# EAGLE design INA250-Evaluation (EAGLE 9.1.3)
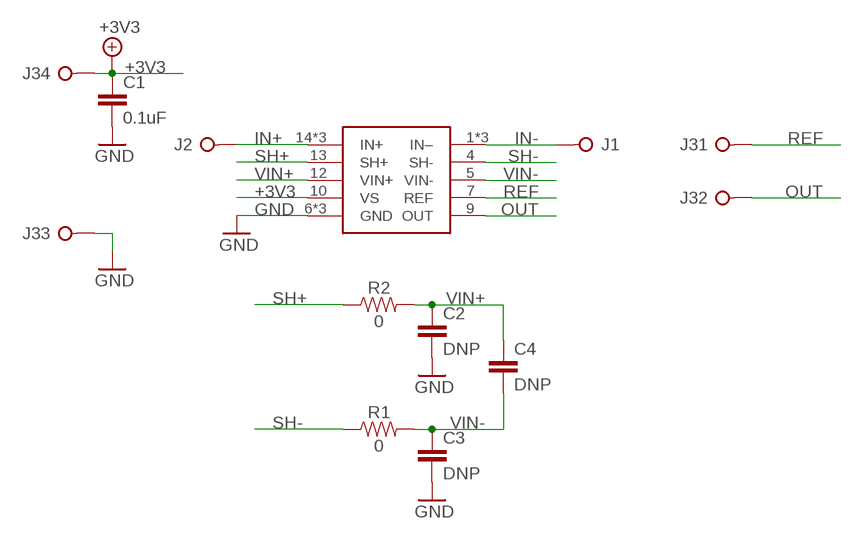
[diagram p0: schematic, sheet 1]

## Parts
C1  0.1uF  CAPACITOR-0805  [CAPACITOR-0805]
C2  DNP  CAPACITOR-0805  [CAPACITOR-0805]
C3  DNP  CAPACITOR-0805  [CAPACITOR-0805]
C4  DNP  CAPACITOR-0805  [CAPACITOR-0805]
IC1  INA250  [TSSOP-16]
J1  PINHD-1X1BIG  [1X01-BIG]
J2  PINHD-1X1BIG  [1X01-BIG]
J3  PINHD-1X4  [1X04]
R1  0  RESISTOR-0805  [RESISTOR-0805]
R2  0  RESISTOR-0805  [RESISTOR-0805]

## Nets
+3V3: C1.1 IC1.10(VS) J3.4
GND: C1.2 C2.2 C3.2 IC1.6(GND) IC1.8(GND) IC1.11(GND) J3.3
IN+: IC1.14(IN+) IC1.15(IN+) IC1.16(IN+) J2.1(KL)
IN-: IC1.1(IN–) IC1.2(IN–) IC1.3(IN–) J1.1(KL)
OUT: IC1.9(OUT) J3.2
REF: IC1.7(REF) J3.1
SH+: IC1.13(SH+) R2.1
SH-: IC1.4(SH-) R1.1
VIN+: C2.1 C4.1 IC1.12(VIN+) R2.2
VIN-: C3.1 C4.2 IC1.5(VIN-) R1.2

## Library data of the parts
C1-C4 = SaintGimp:CAPACITOR: Ceramic Capacitor
IC1 = SaintGimp:INA250: Current Amplifier With Integrated Shunt
J1 J2 = SaintGimp:PINHD-1X1
J3 = SaintGimp:PINHD-1X4
R1 R2 = SaintGimp:RESISTOR-*

## Board
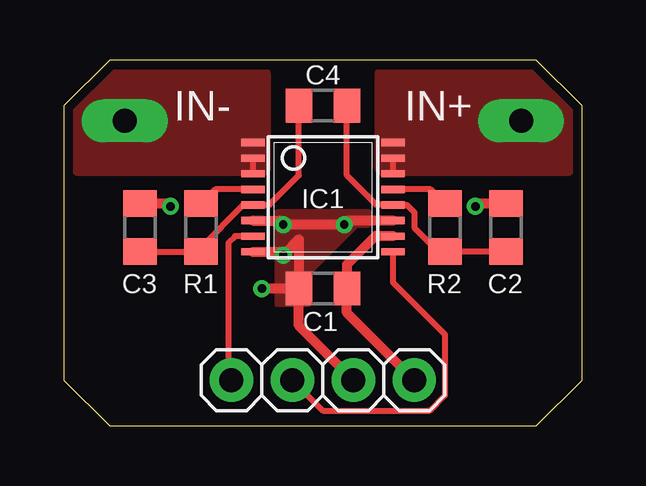
[diagram p1: board, top side]
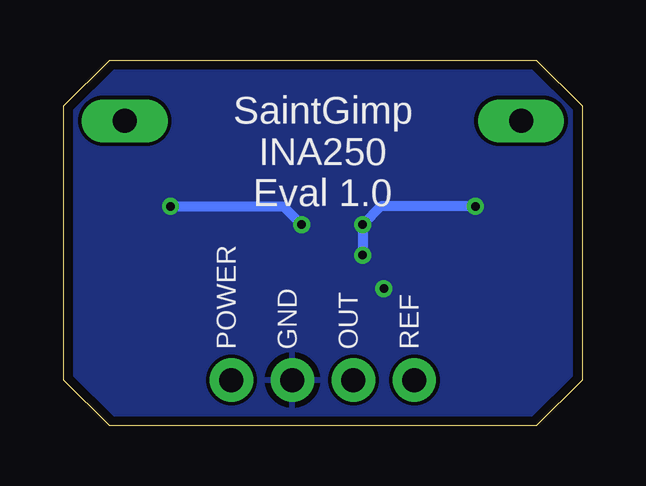
[diagram p2: board, bottom side, seen from below]

Size 21.59 x 15.24 mm. Coordinates in mm from the lower left corner, seen from the top.
Outline: 0,13.34 0,1.91 1.91,0 19.68,0 21.59,1.91 21.59,13.34 19.68,15.24 1.91,15.24 0,13.34
Copper layers (1*16): Top 0.0356mm / dielectric 1.5011mm / Bottom 0.0356mm
Design rules "Saintgimp-OSHPark": minimum track width 10mil, minimum drill 13mil, track to track 6mil, track to pad 6mil, pad to pad 6mil, via to via 6mil, smd to smd 6mil, copper to edge 15mil, drill to drill 6mil, minimum pad ring 12mil, minimum via ring 7mil, stop-mask expansion 2mil, vias tented up to drill 24mil, thermal gap 10mil

### Footprints (pad centres in the part's own frame; a part is rotated, then mirrored left to right if it is on the bottom)
CAPACITOR-0805 = smd 1.1 x 1.4: 1 -1,0; 2 1,0
TSSOP-16 = smd 0.305 x 0.991: 1 -2.275,-2.918; 2 -1.625,-2.918; 3 -0.975,-2.918; 4 -0.325,-2.918; 5 0.325,-2.918; 6 0.975,-2.918; 7 1.625,-2.918; 8 2.275,-2.918; 9 2.275,2.918; 10 1.625,2.918; 11 0.975,2.918; 12 0.325,2.918; 13 -0.325,2.918; 14 -0.975,2.918; 15 -1.625,2.918; 16 -2.275,2.918
1X01-BIG = drill 1 long: 1 0,0
1X04 = drill 1: 1 -3.81,0; 2 -1.27,0; 3 1.27,0; 4 3.81,0
RESISTOR-0805 = smd 1.1 x 1.4: 1 -1,0; 2 1,0

### Placement (x,y rotation side)
C1  10.79,5.71 180 top
C2  18.41,8.26 90 top
C3  3.17,8.26 90 top
C4  10.79,13.34 180 top
IC1  10.79,9.53 270 top
J1  2.54,12.7 90 top
J2  19.05,12.7 90 top
J3  10.79,1.91 0 top
R1  5.71,8.26 270 top
R2  15.88,8.26 270 top

### Tracks (layer width: path | path; a pad name or v marks a point on that pad's centre or on a via)
+3V3
  Top 0.406: J3.4 11.79,4.71 C1.1 11.79,6.71 12.98,7.9 IC1.10
GND  (via drill 0.35)
  Top 0.406: IC1.6 8.98,8.55 v9.14,8.38 v11.68,8.38 11.85,8.55 IC1.11 | IC1.8 9.01,7.25 v9.14,7.11 9.79,7.76 C1.2 | C1.2 v8.26,5.71 | C2.2 17.26,9.26 v17.14,9.14 | J3.3 9.79,4.17 C1.2 | v4.45,9.14 4.33,9.26 C3.2
  Bottom 0.406: v9.14,7.11 v9.14,8.38 8.38,9.14 v4.45,9.14 | v17.14,9.14 12.45,9.14 v11.68,8.38
  pour Bottom: 0,0 0,15.24 21.59,15.24 21.59,0
  pour Top (no thermals): 12.7,8.89 8.89,8.89 8.89,5.08 10.16,5.08 10.16,6.35 11.43,7.62 12.19,8.38 12.45,8.38 12.7,8.38
IN+
  Top 0.254: IC1.15 IC1.14
  pour Top (no thermals): 13.34,10.79 20.95,10.79 20.95,14.61 13.34,14.61
IN-
  Top 0.254: IC1.2 IC1.3
  pour Top (no thermals): 8.26,10.79 0.64,10.79 0.64,14.61 8.26,14.61
OUT
  Top 0.254: J3.2 10.79,0.64 15.24,0.64 15.88,1.27 15.88,3.81 13.71,5.97 IC1.9
REF
  Top 0.254: IC1.7 7.14,7.9 6.86,7.62 6.86,2.03 J3.1
SH+
  Top 0.254: R2.1 15.28,9.85 IC1.13
SH-
  Top 0.254: IC1.4 6.31,9.85 R1.1
VIN+
  Top 0.254: C2.1 R2.2 15.61,7.25 14.61,8.26 14.61,8.89 14.29,9.2 IC1.12 13.03,9.2 11.79,10.43 C4.1
VIN-
  Top 0.254: C3.1 R1.2 5.71,7.43 7.48,9.2 IC1.5 8.56,9.2 9.79,10.43 C4.2

### Text on the board
tPlace: IN- | IN+
bPlace: SaintGimp / INA250 / Eval 1.0 | REF | OUT | GND | POWER